# Altium schematic sheet 08_USB.SchDoc: USB
size A3; Organization: Lime Microsystems; Address1: Surrey Tech Centre; Address2: Guildford GU2 7YG; Address3: Surrey; Address4: United Kingdom; Revision: v1.0; SheetNumber: 8; SheetTotal: 12
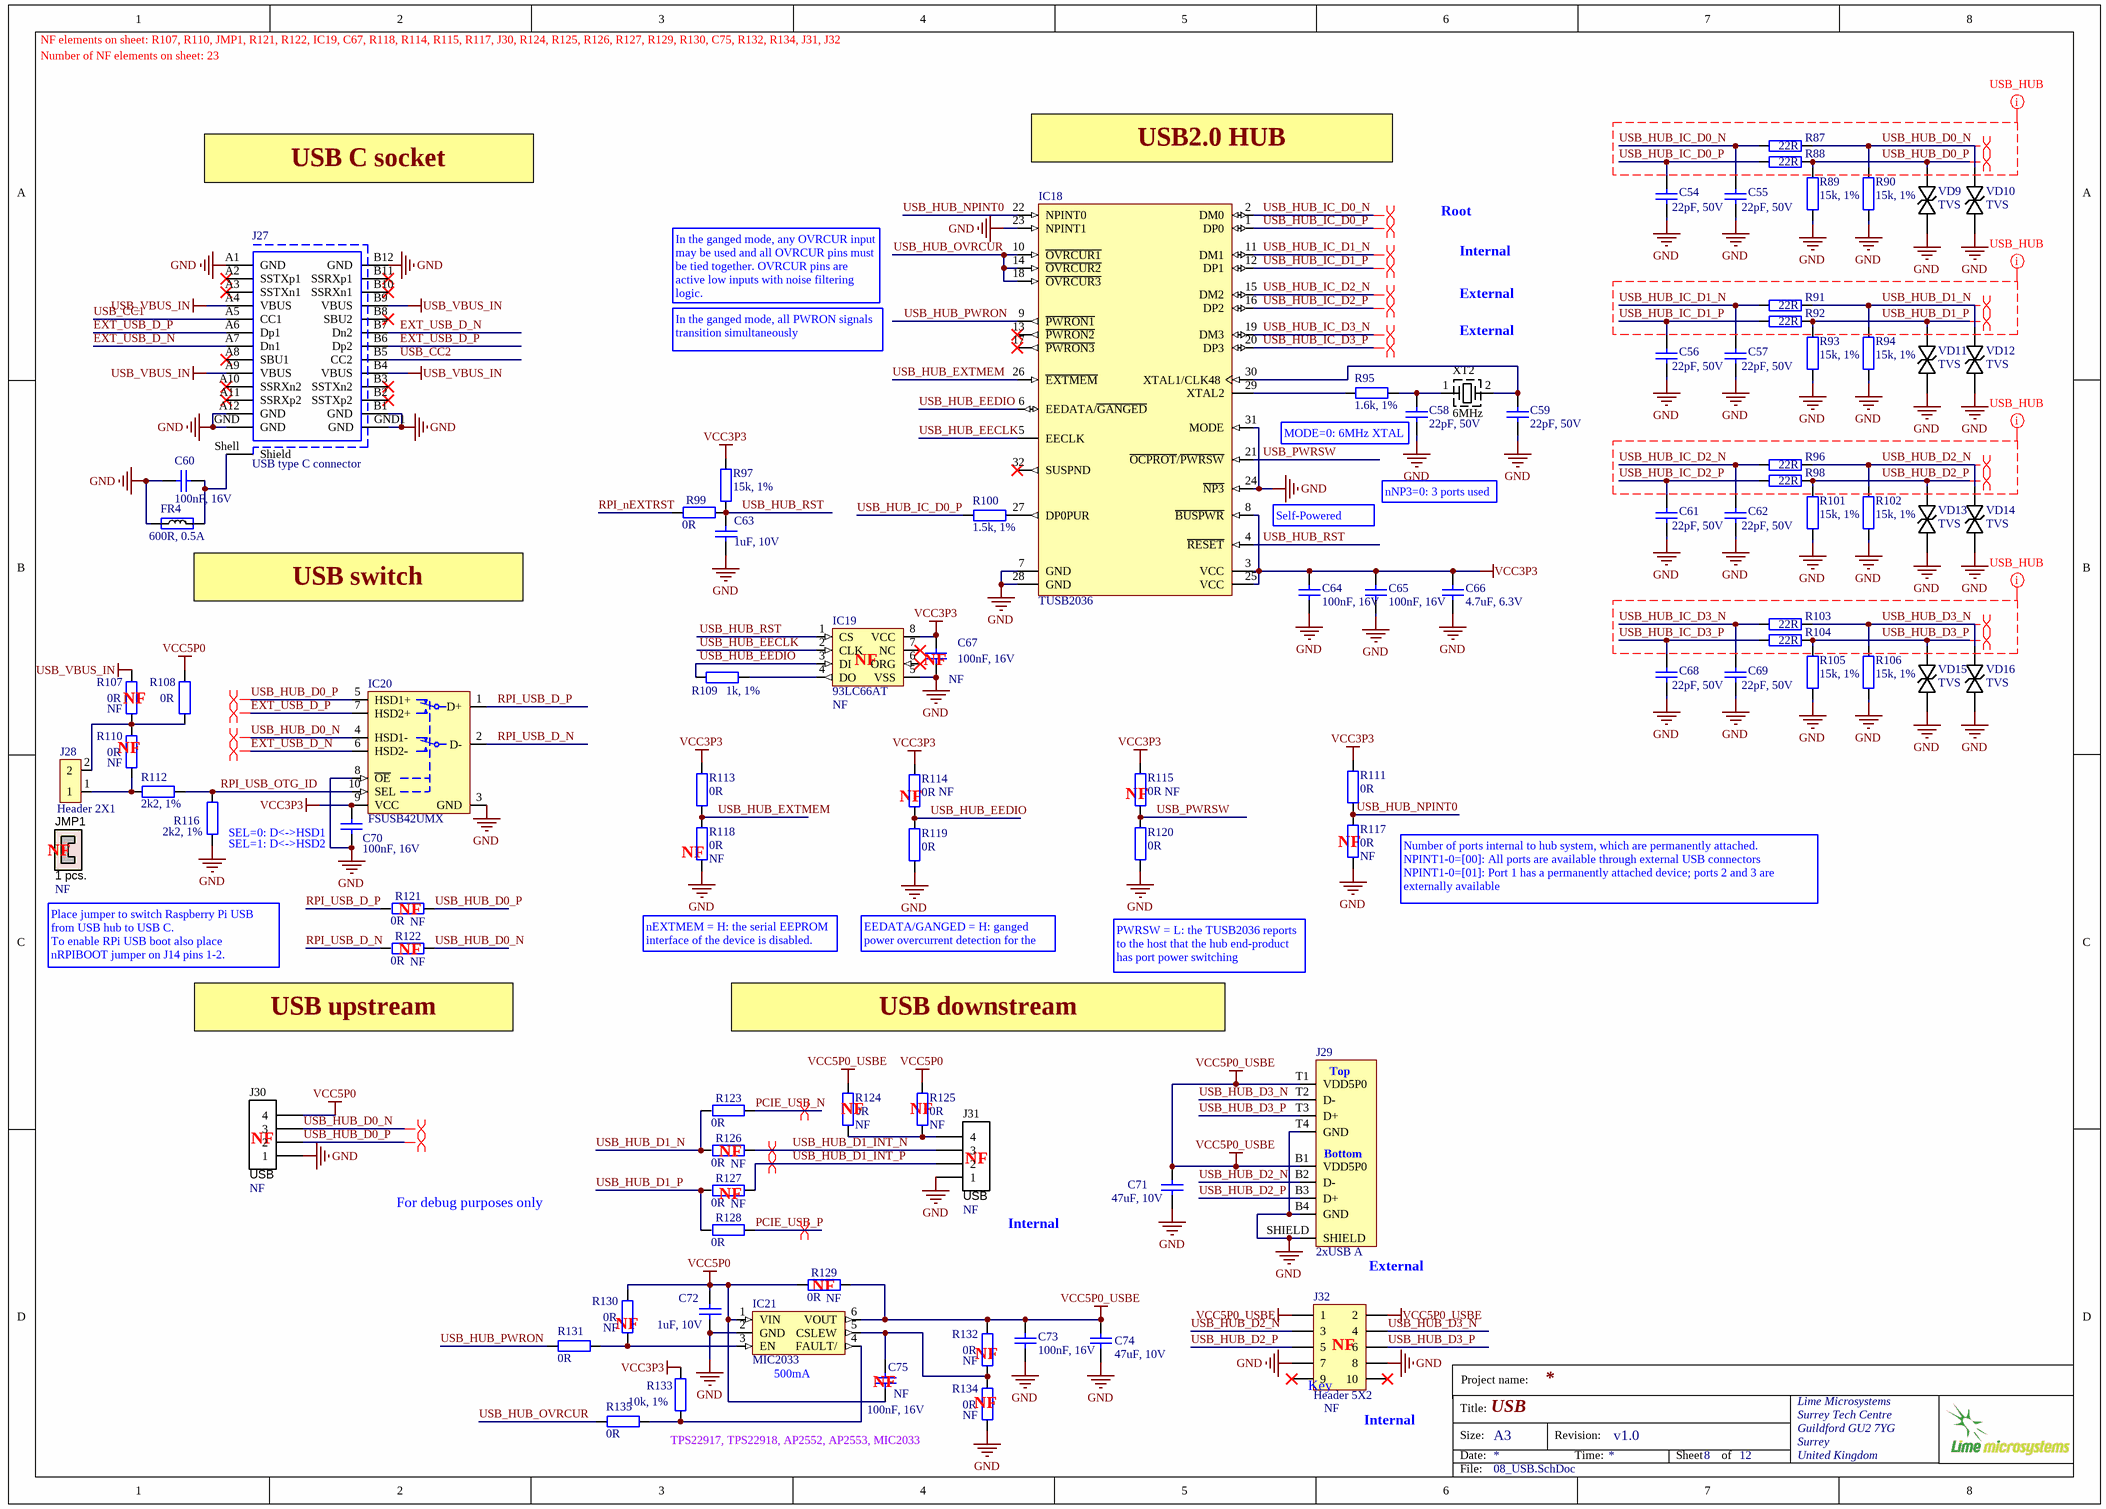
[diagram p0: 08_USB.SchDoc]

## Parts
C54  22pF, 50V  [CAP0402]
C55  22pF, 50V  [CAP0402]
C56  22pF, 50V  [CAP0402]
C57  22pF, 50V  [CAP0402]
C58  22pF, 50V  [CAP0402]
C59  22pF, 50V  [CAP0402]
C60  100nF, 16V  [CAP0402]
C61  22pF, 50V  [CAP0402]
C62  22pF, 50V  [CAP0402]
C63  1uF, 10V  [CAP0402]
C64  100nF, 16V  [CAP0402]
C65  100nF, 16V  [CAP0402]
C66  4.7uF, 6.3V  [CAP0402]
C67  100nF, 16V  Assembly Info: NF  [CAP0402]
C68  22pF, 50V  [CAP0402]
C69  22pF, 50V  [CAP0402]
C70  100nF, 16V  [CAP0402]
C71  47uF, 10V  [CAP1206]
C72  1uF, 10V  [CAP0402]
C73  100nF, 16V  [CAP0402]
C74  47uF, 10V  [CAP1206]
C75  100nF, 16V  Assembly Info: NF  [CAP0402]
FR4  600R, 0.5A  [RES0402]
IC18  TUSB2036  [TUSB2036_USB_HUB_32-LQFP]
IC19  93LC66AT  Assembly Info: NF  [SOIC127P600-8DL_v2]
IC20  FSUSB42UMX  [FSUSB42UMX]
IC21  MIC2033  [SOT23-6]
J27  USB type C connector  [DUAL_USB-C_632723100011]
J28  Header 2X1  [HDR_1x2]
J29  2xUSB A  [USB_typeA_double_USBR-A-D-F-O-TH]
J30  USB  Assembly Info: NF  [HEADER4X1_TH]
J31  USB  Assembly Info: NF  [HEADER4X1_TH]
J32  Header 5X2  Assembly Info: NF  [Header5x2_TH]
JMP1  1 pcs.  Assembly Info: NF  (mechanical)
R87  22R  [RES0402]
R88  22R  [RES0402]
R89  15k, 1%  [RES0402]
R90  15k, 1%  [RES0402]
R91  22R  [RES0402]
R92  22R  [RES0402]
R93  15k, 1%  [RES0402]
R94  15k, 1%  [RES0402]
R95  1.6k, 1%  [RES0402]
R96  22R  [RES0402]
R97  15k, 1%  [RES0402]
R98  22R  [RES0402]
R99  0R  [RES0402]
R100  1.5k, 1%  [RES0402]
R101  15k, 1%  [RES0402]
R102  15k, 1%  [RES0402]
R103  22R  [RES0402]
R104  22R  [RES0402]
R105  15k, 1%  [RES0402]
R106  15k, 1%  [RES0402]
R107  0R  Assembly Info: NF  [RES0402]
R108  0R  [RES0402]
R109  1k, 1%  [RES0402]
R110  0R  Assembly Info: NF  [RES0402]
R111  0R  [RES0402]
R112  2k2, 1%  [RES0402]
R113  0R  [RES0402]
R114  0R  Assembly Info: NF  [RES0402]
R115  0R  Assembly Info: NF  [RES0402]
R116  2k2, 1%  [RES0402]
R117  0R  Assembly Info: NF  [RES0402]
R118  0R  Assembly Info: NF  [RES0402]
R119  0R  [RES0402]
R120  0R  [RES0402]
R121  0R  Assembly Info: NF  [RES0402]
R122  0R  Assembly Info: NF  [RES0402]
R123  0R  [RES0402]
R124  0R  Assembly Info: NF  [RES0402]
R125  0R  Assembly Info: NF  [RES0402]
R126  0R  Assembly Info: NF  [RES0402]
R127  0R  Assembly Info: NF  [RES0402]
R128  0R  [RES0402]
R129  0R  Assembly Info: NF  [RES0402]
R130  0R  Assembly Info: NF  [RES0402]
R131  0R  [RES0402]
R132  0R  Assembly Info: NF  [RES0402]
R133  10k, 1%  [RES0402]
R134  0R  Assembly Info: NF  [RES0402]
R135  0R  [RES0402]
VD9  TVS  [SOD323]
VD10  TVS  [SOD323]
VD11  TVS  [SOD323]
VD12  TVS  [SOD323]
VD13  TVS  [SOD323]
VD14  TVS  [SOD323]
VD15  TVS  [SOD323]
VD16  TVS  [SOD323]
XT2  6MHz  [CRYSTAL_ABLS-6.000MHZ-B4-T]

## Nets
GND: C54.1 C55.1 C56.1 C57.1 C58.1 C59.1 C60.2 C61.1 C62.1 C63.2 C64.2 C65.2 C66.1 C67.2 C68.1 C69.1 C70.2 C71.1 C72.2 C73.2 C74.1 FR4.1 IC18.7(GND) IC18.23(NPINT1) IC18.24(~{NP3}) IC18.28(GND) IC18.31(MODE) IC19.5(VSS) IC20.3(GND) IC20.8(~{OE}) IC21.2(GND) J27.A1(GND) J27.A12(GND) J27.B1(GND) J27.B12(GND) J27.GND J27.GND1(GND) J29.B4(GND) J29.SHIELD J29.T4(GND) J30.1 J31.1 J32.7 J32.8 R89.2 R90.2 R93.2 R94.2 R101.2 R102.2 R105.2 R106.2 R116.2 R117.2 R118.2 R119.2 R120.2 R134.1 VD9.K VD10.K VD11.K VD12.K VD13.K VD14.K VD15.K VD16.K
USB_VBUS_IN: J27.A4(VBUS) J27.A9(VBUS) J27.B4(VBUS) J27.B9(VBUS) R107.2
VCC3P3: C64.1 C65.1 C66.2 C67.1 C70.1 IC18.3(VCC) IC18.8(~{BUSPWR}) IC18.25(VCC) IC19.8(VCC) IC20.9(VCC) R97.1 R111.1 R113.1 R114.1 R115.1 R133.2
VCC5P0: C72.1 C75.2 IC21.1(VIN) J30.4 R108.2 R125.1 R129.2 R130.2
VCC5P0_USBE: C71.2 C73.1 C74.2 IC21.6(VOUT) J29.B1(VDD5P0) J29.T1(VDD5P0) J32.1 J32.2 R124.1 R129.1 R132.2
EXT_USB_D_N: IC20.6(HSD2-) J27.A7(Dn1) J27.B7(Dn2)
EXT_USB_D_P: IC20.7(HSD2+) J27.A6(Dp1) J27.B6(Dp2)
PCIE_USB_N: R123.1
PCIE_USB_P: R128.1
RPI_nEXTRST: R99.2
RPI_USB_D_N: IC20.2(D-) R122.2
RPI_USB_D_P: IC20.1(D+) R121.2
RPI_USB_OTG_ID: IC20.10(SEL) R112.2 R116.1
USB_CC1: J27.A5(CC1)
USB_CC2: J27.B5(CC2)
USB_HUB_D0_N: IC20.4(HSD1-) J30.3 R87.2 R90.1 R122.1 VD10.A
USB_HUB_D0_P: IC20.5(HSD1+) J30.2 R88.2 R89.1 R121.1 VD9.A
USB_HUB_D1_INT_N: J31.3 R126.1
USB_HUB_D1_INT_P: J31.2 R127.1
USB_HUB_D1_N: R91.2 R94.1 R123.2 R126.2 VD12.A
USB_HUB_D1_P: R92.2 R93.1 R127.2 R128.2 VD11.A
USB_HUB_D2_N: J29.B2(D-) J32.3 R96.2 R102.1 VD14.A
USB_HUB_D2_P: J29.B3(D+) J32.5 R98.2 R101.1 VD13.A
USB_HUB_D3_N: J29.T2(D-) J32.4 R103.2 R106.1 VD16.A
USB_HUB_D3_P: J29.T3(D+) J32.6 R104.2 R105.1 VD15.A
USB_HUB_EECLK: IC18.5(EECLK) IC19.2(CLK)
USB_HUB_EEDIO: IC18.6(EEDATA/~{GANGED}) IC19.3(DI) R109.1 R114.2 R119.1
USB_HUB_EXTMEM: IC18.26(~{EXTMEM}) R113.2 R118.1
USB_HUB_IC_D0_N: C55.2 IC18.2(DM0) R87.1
USB_HUB_IC_D0_P: C54.2 IC18.1(DP0) R88.1 R100.1
USB_HUB_IC_D1_N: C57.2 IC18.11(DM1) R91.1
USB_HUB_IC_D1_P: C56.2 IC18.12(DP1) R92.1
USB_HUB_IC_D2_N: C62.2 IC18.15(DM2) R96.1
USB_HUB_IC_D2_P: C61.2 IC18.16(DP2) R98.1
USB_HUB_IC_D3_N: C69.2 IC18.19(DM3) R103.1
USB_HUB_IC_D3_P: C68.2 IC18.20(DP3) R104.1
USB_HUB_NPINT0: IC18.22(NPINT0) R111.2 R117.1
USB_HUB_OVRCUR: IC18.10(~{OVRCUR1}) IC18.14(~{OVRCUR2}) IC18.18(~{OVRCUR3}) R135.2
USB_HUB_PWRON: IC18.9(~{PWRON1}) R131.2
USB_HUB_RST: C63.1 IC18.4(~{RESET}) IC19.1(CS) R97.2 R99.1
USB_PWRSW: IC18.21(~{OCPROT}/~{PWRSW}) R115.2 R120.1
NetC58_2: C58.2 R95.2 XT2.1(X)
NetC59_2: C59.2 IC18.30(XTAL1/CLK48) XT2.2(X)
NetC60_1: C60.1 FR4.2 J27.Shell(Shield)
NetC75_1: C75.1 IC21.5(CSLEW) R132.1 R134.2
NetIC18_27: IC18.27(DP0PUR) R100.2
NetIC18_29: IC18.29(XTAL2) R95.1
NetIC19_4: IC19.4(DO) R109.2
NetIC21_3: IC21.3(EN) R130.1 R131.1
NetIC21_4: IC21.4(FAULT/) R133.1 R135.1
NetJ28_1: J28.1 R110.1 R112.1
NetJ28_2: J28.2 R107.1 R108.1 R110.2
NetJ31_4: J31.4 R124.2 R125.2

Not connected (* = marked no-connect by the designer): IC18 13(~{PWRON2})* 17(~{PWRON3})* 32(SUSPND)*; IC19 6(ORG)* 7(NC)*; J27 A2(SSTXp1)* A3(SSTXn1)* A8(SBU1)* A10(SSRXn2)* A11(SSRXp2)* B2(SSTXp2)* B3(SSTXn2)* B8(SBU2)* B10(SSRXn1)* B11(SSRXp1)*; J32 9* 10*; JMP1 1 2

## Layout directives
differential pair: EXT_USB_D_N, EXT_USB_D_P, PCIE_USB_N, PCIE_USB_P, USB_HUB_D0_N, USB_HUB_D0_P, USB_HUB_D1_INT_N, USB_HUB_D1_INT_P, USB_HUB_D1_N, USB_HUB_D1_P, USB_HUB_D2_N, USB_HUB_D2_P, USB_HUB_D3_N, USB_HUB_D3_P, USB_HUB_IC_D0_N, USB_HUB_IC_D0_P, USB_HUB_IC_D1_N, USB_HUB_IC_D1_P, USB_HUB_IC_D2_N, USB_HUB_IC_D2_P, USB_HUB_IC_D3_N, USB_HUB_IC_D3_P
net class USB_HUB: USB_HUB_D0_N, USB_HUB_D0_P, USB_HUB_D1_N, USB_HUB_D1_P, USB_HUB_D2_N, USB_HUB_D2_P, USB_HUB_D3_N, USB_HUB_D3_P, USB_HUB_IC_D0_N, USB_HUB_IC_D0_P, USB_HUB_IC_D1_N, USB_HUB_IC_D1_P, USB_HUB_IC_D2_N, USB_HUB_IC_D2_P, USB_HUB_IC_D3_N, USB_HUB_IC_D3_P

## Notes on the sheet
- NF elements on sheet: R107, R110, JMP1, R121, R122, IC19, C67, R118, R114, R115, R117, J30, R124, R125, R126, R127, R129, R130, C75, R132, R134, J31, J32
- Number of NF elements on sheet: 23
- USB C socket
- (near IC18) USB2.0 HUB
- Root
- In the ganged mode, any OVRCUR input may be used and all OVRCUR pins must be tied together. OVRCUR pins are active low inputs with noise filtering logic.
- Internal
- External
- In the ganged mode, all PWRON signals
  transition simultaneously
- (near C58) MODE=0: 6MHz XTAL
- nNP3=0: 3 ports used
- Self-Powered
- (near FR4) USB switch
- (near R107) NF
- (near IC19) NF
- (near C67) NF
- (near R110) NF
- (near JMP1) NF
- (near R116) SEL=0: D<->HSD1
- (near R116) SEL=1: D<->HSD2
- (near R118) NF
- (near R114) NF
- (near R115) NF
- (near R117) NF
- (near R121) NF
- Number of ports internal to hub system, which are permanently attached.
  NPINT1-0=[00]: All ports are available through external USB connectors
  NPINT1-0=[01]: Port 1 has a permanently attached device; ports 2 and 3 are externally available
- Place jumper to switch Raspberry Pi USB from USB hub to USB C.
  To enable RPi USB boot also place nRPIBOOT jumper on J14 pins 1-2.
- (near R122) NF
- nEXTMEM = H: the serial EEPROM interface of the device is disabled.
- (near R119) EEDATA/GANGED = H: ganged power overcurrent detection for the downstream ports.
- PWRSW = L: the TUSB2036 reports to the host that the hub end-product has port power switching
- (near R122) USB upstream
- USB downstream
- (near R124) NF
- (near R125) NF
- (near J30) NF
- (near R126) NF
- (near J31) NF
- (near J30) For debug purposes only
- (near R127) NF
- (near J31) Internal
- (near R130) NF
- (near R129) NF
- (near J29) External
- (near IC21) 500mA
- (near C75) NF
- (near R132) NF
- (near J32) Key
- (near J32) NF
- TPS22917, TPS22918, AP2552, AP2553, MIC2033
- (near R134) NF
- (near J32) Internal
- Project name:
- Title:
- Size:
- Date:
- A3
- Revision:
- Time:
- Sheet
- of
- File:
- (in symbol USB_typeA_double_USBR-A-D-F-O-TH) Top; Bottom

## Library data of the parts
C54-C59 C61 C62 C68 C69 = Cap_0402: Manufacturer: Yageo; Manufacturer Part Number 1: CC0402JRNPO9BN220; Part Description: 22pF ±5% 50V C0G, NP0 Ceramic Capacitor -55°C ~ 125°C Surface Mount, MLCC 0402 (1005 Metric) 0.039" L x 0.020" W (1.00mm x 0.50mm); Tolerance: ±5%; Temperature Coefficient: C0G, NP0; Value: 22pF, 50V; Supplier 1: Digi-Key; Supplier Part Number 1: 311-1018-2-ND; Category: Capacitors; Voltage - Rated: 50V; Packaging: Tape & Reel (TR); RoHS: RoHS Compliant; Capacitance: 22pF; Operating Temperature: -55°C ~ 125°C; Mounting Type: Surface Mount, MLCC; Height - Seated (Max): -; Size / Dimension: 0.039" L x 0.020" W (1.00mm x 0.50mm); Ratings: -; Applications: General Purpose; Thickness (Max): 0.022" (0.55mm); Lead Spacing: -; Lead Style: -; Features: -; Package / Case: 0402 (1005 Metric)
C60 = Cap_0603: Manufacturer Part Number 1: GRM155R71C104KA88D; Part Description: 0.10µF ±10% 16V Ceramic Capacitor X7R 0402 (1005 Metric); Brand: Murata Electronics; Tolerance: 10 %; Type: General Purpose MLCC; Capacitance: 0.1 uF; Temperature Coefficient / Code: +/- 15 %; Supplier 1: Mouser; Supplier Part Number 1: 81-GRM155R71C104KA88; Case Code - in: 0402; Manufacturer: Murata Electronics; Category: Multilayer Ceramic Capacitors MLCC - SMD/SMT; Voltage Rating DC: 16 V; Value: 100nF, 16V; Manufacturer Part Number: GRM155R71C104KA88D
C63 C72 = Cap_0402: Manufacturer Part Number 1: CC0402MRX5R6BB105; Manufacturer: Yageo; Part Description: 1µF 10V Ceramic Capacitor X5R 0402 (1005 Metric) 0.039" L x 0.020" W (1.00mm x 0.50mm); Voltage Rating: 10; Capacitance Tolerance: ± 10%; Product Range: TDK - C Series; Ceramic Capacitor Case: 0402 [1005 Metric]; Capacitance: 1; Dielectric Characteristic: X6; Value: 1uF, 10V; Supplier 1: Digi-Key; Supplier Part Number 1: 311-1732-1-ND; MSL: -; RoHS: YES
C64 C65 C67 C70 = Cap_0402: Manufacturer: Murata Electronics; Manufacturer Part Number: GRM155R71C104KA88D; Part Description: 0.10µF ±10% 16V Ceramic Capacitor X7R 0402 (1005 Metric); Tolerance: 10 %; Type: General Purpose MLCC; Capacitance: 0.1 uF; Case Length: 1 mm; Dielectric: X7R; Case Height: 0.5 mm; Temperature Coefficient / Code: +/- 15 %; Value: 100nF, 16V; Supplier 1: Mouser; Supplier Part Number 1: 81-GRM155R71C104KA88; Case Code - in: 0402; RoHS: RoHS Compliant; Operating Temperature Range: - 55 C to + 125 C; Series: GRM; Termination Style: SMD/SMT; Package / Case: 0402 (1005 metric); Voltage Rating DC: 16 V; Maximum Operating Temperature: + 125 C; Case Code - mm: 1005; Minimum Operating Temperature: - 55 C; Product Category: Low & Medium Capacitance SMD Ceramic Chip Capacitors; Packaging: Reel; Product: General Type MLCCs; Category: Multilayer Ceramic Capacitors MLCC - SMD/SMT; Brand: Murata Electronics; Case Width: 0.5 mm; RoHS - Mouser: Y; Standard Pack Qty: 10000; Minimum Order Quantity: 1; Reeling: True; Manufacturer Part Number 1: GRM155R71C104KA88D
C66 = Cap_0402: Manufacturer: Murata Electronics North America; Manufacturer Part Number 1: GRM155R60J475ME87D; Part Description: 4.7µF ±20% 6.3V X5R Ceramic Capacitor -55°C ~ 85°C Surface Mount, MLCC 0402 (1005 Metric) 0.039" L x 0.020" W (1.00mm x 0.50mm); Tolerance: ±20%; Capacitance: 4.7µF; Temperature Coefficient: X5R; Lead Style: -; Ratings: -; Height - Seated (Max): -; Thickness (Max): 0.022" (0.55mm); Voltage - Rated: 6.3V; Packaging: Cut Tape (CT); Lead Spacing: -; Category: Capacitors; Supplier Part Number 1: 490-5408-1-ND; Applications: General Purpose; Operating Temperature: -55°C ~ 85°C; Mounting Type: Surface Mount, MLCC; Features: Derating Recommended; RoHS: RoHS Compliant; Supplier 1: Digi-Key; Package / Case: 0402 (1005 Metric); Size / Dimension: 0.039" L x 0.020" W (1.00mm x 0.50mm); Value: 4.7uF, 6.3V
C71 C74 = Cap_1206: Manufacturer: TDK Corporation; Manufacturer Part Number 1: C3216X6S1A476M160AC; Part Description: 47µF ±20% 10V Ceramic Capacitor X6S 1206 (3216 Metric); Notification: Current market demand for these product types have resulted in fluctuating and extending lead times. Lead times may differ.; Tolerance: ±20%; Temperature Coefficient: X6S; Value: 47uF, 10V; RoHS: RoHS Compliant; Packaging: Cut Tape (CT); Operating Temperature: -55°C ~ 105°C; Voltage - Rated: 10V; Height - Seated (Max): -; Ratings: -; Applications: General Purpose; Features: Low ESL; Size / Dimension: 0.126" L x 0.063" W (3.20mm x 1.60mm); Supplier 1: Digi-Key; Lead Spacing: -; Supplier Part Number 1: 445-6010-1-ND; Thickness (Max): 0.071" (1.80mm); Failure Rate: -; Category: Capacitors; Lead Style: -; Part Status: Active; Mounting Type: Surface Mount, MLCC; Package / Case: 1206 (3216 Metric)
C73 C75 = Cap_0402: Manufacturer: Murata Electronics; Manufacturer Part Number 1: GRM155R71C104KA88D; Part Description: 0.10µF ±10% 16V Ceramic Capacitor X7R 0402 (1005 Metric); Tolerance: 10 %; Type: General Purpose MLCC; Capacitance: 0.1 uF; Case Length: 1 mm; Dielectric: X7R; Case Height: 0.5 mm; Temperature Coefficient / Code: +/- 15 %; Value: 100nF, 16V; Supplier 1: Mouser; Supplier Part Number 1: 81-GRM155R71C104KA88; Case Code - in: 0402; RoHS: RoHS Compliant; Operating Temperature Range: - 55 C to + 125 C; Series: GRM; Termination Style: SMD/SMT; Package / Case: 0402 (1005 metric); Voltage Rating DC: 16 V; Maximum Operating Temperature: + 125 C; Case Code - mm: 1005; Minimum Operating Temperature: - 55 C; Product Category: Low & Medium Capacitance SMD Ceramic Chip Capacitors; Packaging: Reel; Product: General Type MLCCs; Category: Multilayer Ceramic Capacitors MLCC - SMD/SMT; Brand: Murata Electronics; Case Width: 0.5 mm; RoHS - Mouser: Y; Standard Pack Qty: 10000; Minimum Order Quantity: 1; Reeling: True; Manufacturer Part Number: GRM155R71C104KA88D
FR4 = Ferrite: Manufacturer: Murata; Manufacturer Part Number 1: BLM15AX601SN1D; Part Description: - Ferrite Bead 0402 (1005 Metric) 500mA 340mOhm; Tolerance: 25%; Current Rating: 500mA; Number of Lines: 1; DC Resistance (DCR): 340mR; Test Frequency: 100MHz; Value: 600R, 0.5A; Supplier 1: Digi-Key; Supplier Part Number 1: 490-5441-1-ND; Stock 1: 416370; Pricing 1: 1=0.1, 10=0.06, 25=0.0552, 50=0.0496, 100=0.0363, 250=0.0264, 500=0.0242, 1000=0.0209, 5000=0.0165 (USD); Case/Package: 0402; Number of Pins: 2; Case Code (Metric): 1005; Case Code (Imperial): 0402; Core Material: Ferrite; Material: Steel,Ferrite; Min Operating Temperature: -55°C; Max Operating Temperature: 125°C; Package Quantity: 1; Packaging: Tape and Reel; Series: BLM15AX_SN; Impedance: 600R; Max Current Rating: 500mA; Termination: SMD/SMT; Max DC Current: 500mA; Number of Circuits: 1; DC Resistance-Max: 340mR; Length: 1mm; Width: 0.5mm; Height: 0.5mm; Depth: 0.5mm; REACH SVHC: No SVHC; Lead Free: Lead Free; RoHS Compliant: Yes; ComponentLink1URL: https://www.murata.com/en-us/products/productdata/8796740059166/ENFA0018.pdf?src-supplier=Digi-Key; ComponentLink1Description: https://www.murata.com/en-us/products/productdata/8796740059166/ENFA0018.pdf?src-supplier=Digi-Key; ComponentLink2URL: http://search.murata.co.jp/Ceramy/image/img/PDF/ENG/L0110S0100BLM15AX_SN.pdf?src-supplier=Future+Electronics; ComponentLink2Description: http://search.murata.co.jp/Ceramy/image/img/PDF/ENG/L0110S0100BLM15AX_SN.pdf?src-supplier=Future+Electronics; ComponentLink3URL: http://www.produktinfo.conrad.com/datenblaetter/1100000-1199999/001171675-da-01-en-CHIP_DROSSEL0402_600R_420MA_1_0X0_5MM.pdf?src-supplier=Conrad; ComponentLink3Description: http://www.produktinfo.conrad.com/datenblaetter/1100000-1199999/001171675-da-01-en-CHIP_DROSSEL0402_600R_420MA_1_0X0_5MM.pdf?src-supplier=Conrad; ComponentLink4URL: http://www.produktinfo.conrad.com/datenblaetter/1100000-1199999/001172169-da-01-en-DROSSEL_0402_600R_1_0X0_5MM_10000ST.pdf?src-supplier=Conrad; ComponentLink4Description: http://www.produktinfo.conrad.com/datenblaetter/1100000-1199999/001172169-da-01-en-DROSSEL_0402_600R_1_0X0_5MM_10000ST.pdf?src-supplier=Conrad
IC18 = TUSB2036_USB_HUB: Part Description: USB Hub Controller USB 2.0 USB Interface 32-LQFP (7x7); Manufacturer: Texas Instruments; Manufacturer Part Number 1: TUSB2036VF; Operating Supply Voltage: 3.3V; Operating Supply Current: 40mA; Data Rate: 12Mbps; Min Supply Voltage: 3V; Max Supply Voltage: 3.6V; Number of Ports: 3; USB Standard: USB 2.0; ComponentLink1URL: https://datasheet.ciiva.com/1505/1535702-1505189.pdf?src-supplier=Element14; ComponentLink1Description: https://datasheet.ciiva.com/1505/1535702-1505189.pdf?src-supplier=Element14; ComponentLink2URL: https://datasheet.ciiva.com/1613/tusb2036-1613315.pdf?src-supplier=Newark; ComponentLink2Description: https://datasheet.ciiva.com/1613/tusb2036-1613315.pdf?src-supplier=Newark; ComponentLink3URL: https://datasheet.ciiva.com/15134/getdatasheetpartid-225880-15134503.pdf?src-supplier=Verical; ComponentLink3Description: https://datasheet.ciiva.com/15134/getdatasheetpartid-225880-15134503.pdf?src-supplier=Verical; ComponentLink4URL: https://datasheet.ciiva.com/5835/1535702-5835498.pdf?src-supplier=Farnell; ComponentLink4Description: https://datasheet.ciiva.com/5835/1535702-5835498.pdf?src-supplier=Farnell; ComponentLink5URL: https://datasheet.ciiva.com/1695/tusb2036-1695700.pdf?src-supplier=Digi-Key; ComponentLink5Description: https://datasheet.ciiva.com/1695/tusb2036-1695700.pdf?src-supplier=Digi-Key; ComponentLink6URL: https://datasheet.ciiva.com/41461/001187495-da-01-en-ic-2-3-port-usb-h-tusb2036vf-lqfp-32-tid-41461301.pdf?src-supplier=Conrad; ComponentLink6Description: https://datasheet.ciiva.com/41461/001187495-da-01-en-ic-2-3-port-usb-h-tusb2036vf-lqfp-32-tid-41461301.pdf?src-supplier=Conrad; Supplier 1: Digi-Key; Supplier Part Number 1: 296-11086-ND; Stock 1: 77; Pricing 1: 1=4,18000, 10=3,75400, 25=3,54880, 80=3,07575, 250=2,91796, 500=2,61828, 1000=2,38080 (USD); RoHS: Yes; Case/Package: LQFP; Number of Pins: 32; Weight: 0.006148oz; Min Operating Temperature: 0°C; Max Operating Temperature: 70°C; Package Quantity: 250; Packaging: Tray; Termination: SMD/SMT; Length: 7mm; Width: 7mm; Height: 1.4mm; Radiation Hardening: No; Lead Free: Lead Free; RoHS Compliant: Yes; REACH SVHC: No SVHC
IC19 = 93LC66AT-I/SN_EEPROM: Part Description: EEPROM Memory IC 4Kb (512 x 8) SPI 2MHz 8-SOIC; Manufacturer: Microchip Technology; Memory Type: Non-Volatile; Memory Format: EEPROM; Memory Size: 4Kb (512 x 8); Write Cycle Time - Word, Page: 6ms; Memory Interface: SPI; Voltage - Supply: 2.5 V ~ 5.5 V; Supplier 1: Digi-Key; Manufacturer Part Number 1: 93LC66AT-I/SN; RoHS: RoHS Compliant; Category: Integrated Circuits (ICs); Stock 1: 6857; Pricing 1: 1=0.27, 25=0.2576, 100=0.2543 (USD); Packaging: Digi-Reel®; Part Status: Active; Technology: EEPROM; Operating Temperature: -40°C ~ 85°C (TA); Mounting Type: Surface Mount; Package / Case: 8-SOIC (0.154", 3.90mm Width); Supplier Device Package: 8-SOIC; ComponentLink1URL: http://www.microchip.com/mymicrochip/filehandler.aspx?ddocname=en011819; ComponentLink1Description: http://www.microchip.com/mymicrochip/filehandler.aspx?ddocname=en011819; Supplier Part Number 1: 93LC66AT-I/SNDKR-ND
IC20 = FSUSB42UMX: Part Description: USB Switch IC 1 Channel 10-UMLP (1.8x1.4); Manufacturer: ON Semiconductor; Switch Circuit: DPDT; On-State Resistance (Max): 6.5 Ohm; Voltage - Supply, Single (V+): 2.4 V ~ 4.4 V; -3db Bandwidth: 720MHz; Supplier 1: Digi-Key; Manufacturer Part Number 1: FSUSB42UMX; RoHS: RoHS Compliant; Category: Integrated Circuits (ICs); Stock 1: 8344; Pricing 1: 1=0.59, 10=0.502, 100=0.3749, 500=0.29458, 1000=0.22763 (USD); Packaging: Cut Tape (CT); Part Status: Active; Applications: USB; Multiplexer/Demultiplexer Circuit: -; Voltage - Supply, Dual (V±): -; Features: Break-Before-Make, USB 2.0; Operating Temperature: -40°C ~ 85°C (TA); Package / Case: 10-UFQFN; Supplier Device Package: 10-UMLP (1.8x1.4); Base Part Number: FSUSB42; ComponentLink1URL: https://www.fairchildsemi.com/datasheets/FS/FSUSB42.pdf; ComponentLink1Description: https://www.fairchildsemi.com/datasheets/FS/FSUSB42.pdf; Supplier Part Number 1: FSUSB42UMXCT-ND
IC21 = MIC2033_power_switch: Manufacturer: Microchip; Manufacturer Part Number 1: MIC2033-05AYM6-TR; Part Description: Power Switch ICs - Power Distribution 500mA High-Side, Power Distribution Switch; Number of Outputs: 1; Interface: On/Off; Max Output Current: 500mA; Fault Protection: Over Temperature; Output Configuration: High Side; Supplier 1: Digi-Key; Supplier Part Number 1: 576-4143-1-ND; Stock 1: 1966; Pricing 1: 1=0,80000, 25=0,65720, 100=0,61500 (USD); RoHS: Yes; Mount: Surface Mount; Case/Package: SOT-23-6; Number of Pins: 6; Min Operating Temperature: -40°C; Max Operating Temperature: 125°C; Packaging: Tape and Reel; Package Quantity: 3000; Series: -; Number of Switches: 1; RoHS Compliant: Yes; ComponentLink1URL: http://www.mouser.com/ds/2/268/mic2033-b-1076865.pdf?src-supplier=Mouser; ComponentLink1Description: http://www.mouser.com/ds/2/268/mic2033-b-1076865.pdf?src-supplier=Mouser; ComponentLink2URL: http://components.arrow.com/part/dataview/56727820S413982N1374?src-supplier=Arrow+Electronics; ComponentLink2Description: http://components.arrow.com/part/dataview/56727820S413982N1374?src-supplier=Arrow+Electronics; ComponentLink3URL: http://www.microchip.com/mymicrochip/filehandler.aspx?ddocname=en579457&src-supplier=Digi-Key; ComponentLink3Description: http://www.microchip.com/mymicrochip/filehandler.aspx?ddocname=en579457&src-supplier=Digi-Key
J27 = DUAL_USB-C_632723100011: Manufacturer: Wurth Electronics; Part Description: USB - C (Type - C) USB 3.1 (USB 3.1 Gen 2, Superspeed+) Receptacle Connector 24 Position Surface Mount, Right Angle; Through Hole; Number of Contacts: 24; Gender: Receptacle; ComponentLink1URL: http://www.alliedelec.com/m/d/e03b7b5d71e2d3e369c52d5c8eaca2b6.pdf?src-supplier=Allied+Electronics; ComponentLink1Description: http://www.alliedelec.com/m/d/e03b7b5d71e2d3e369c52d5c8eaca2b6.pdf?src-supplier=Allied+Electronics; ComponentLink2URL: http://www.jae.com/z-en/pdf_download_exec.cfm?param=SJ115995.pdf&src-supplier=Digi-Key; ComponentLink2Description: http://www.jae.com/z-en/pdf_download_exec.cfm?param=SJ115995.pdf&src-supplier=Digi-Key; Supplier 1: Digi-Key; Supplier Part Number 1: 732-9617-1-ND; Manufacturer Part Number 1: 632723100011; Stock 1: 1127; Pricing 1: 1=4,10000, 10=3,80000, 50=3,20000, 100=2,95000 (USD); RoHS: Yes; Mount: Surface Mount,Through Hole; Packaging: Tape and Reel; Connector Type: USB; ComponentLink3URL: https://www.mouser.com/ds/2/445/632723x00011-782157.pdf?src-supplier=Mouser; ComponentLink3Description: https://www.mouser.com/ds/2/445/632723x00011-782157.pdf?src-supplier=Mouser; ComponentLink4URL: https://katalog.we-online.de/em/datasheet/632723x00011.pdf?src-supplier=Digi-Key; ComponentLink4Description: https://katalog.we-online.de/em/datasheet/632723x00011.pdf?src-supplier=Digi-Key
J28 = Jumper: Manufacturer Part Number 1: 961102-6404-AR; Part Description: 2 Positions Header, Unshrouded Connector 0.100" (2.54mm) Through Hole Gold; Manufacturer: 3M; Connector Type: Header, Unshrouded; Supplier 1: Digi-Key; Supplier Part Number 1: 3M9447-ND; Contact Type: Male Pin; Color: Black; Mounting Type: Through Hole; Category: Connectors, Interconnects; Contact Finish: Gold
J29 = USB_typeA_double_USBR-A-D-F-O-TH: Manufacturer: Samtec; Part Description: USB - A USB 2.0 Receptacle Connector 8 Position Through Hole, Right Angle; Number of Contacts: 4; Number of Ports: 1; Max Voltage Rating (AC): 30V; Gender: Female; Supplier 1: Digi-Key; Manufacturer Part Number 1: USBR-A-D-F-O-TH; Stock 1: 2359; Pricing 1: 1=1.6, 10=1.448, 25=1.3592, 50=1.3002, 100=1.2411, 250=1.12292, 500=1.03426, 1000=0.8865, 2500=0.8274 (USD); Mount: Through Hole; Contact Material: Bronze; Contact Plating: Gold; Number of Terminals: 4; Housing Material: Thermoplastic; Min Operating Temperature: -50°C; Max Operating Temperature: 85°C; Packaging: Bulk; Termination: Solder; Orientation: Right Angle; Radiation Hardening: No; Supplier Part Number 1: SAM10376-ND
J30 J31 = Header4P: Header, 4-pin; Part Description: 4 Positions Header Connector 0.100" (2.54mm) Through Hole Gold; Manufacturer: Wurth Electronics Inc.; Manufacturer Part Number 1: 61300411121; Pitch - Mating: 0.100" (2.54mm); Number of Positions: 4; Number of Positions Loaded: All; Style: Board to Board or Cable; Shrouding: Unshrouded; Contact Length - Mating: 0.236" (6.00mm); Contact Length - Post: 0.118" (3.00mm); Overall Contact Length: 0.454" (11.54mm); Material Flammability Rating: UL94 V-0; Current Rating: 3A; Voltage Rating: 250V; Supplier 1: Digi-Key; Supplier Part Number 1: 732-5317-ND; RoHS: RoHS Compliant; Category: Connectors, Interconnects; Stock 1: 25204; Pricing 1: 1=0.18, 10=0.153, 25=0.1272, 50=0.106, 100=0.096, 1000=0.088 (USD); Packaging: Bulk; Part Status: Active; Connector Type: Header; Contact Type: Male Pin; Number of Rows: 1; Row Spacing - Mating: -; Mounting Type: Through Hole; Termination: Solder; Fastening Type: Push-Pull; Insulation Height: 0.100" (2.54mm); Contact Shape: Square; Contact Finish - Mating: Gold; Contact Finish Thickness - Mating: -; Contact Finish - Post: -; Contact Material: Copper Alloy; Insulation Material: Polybutylene Terephthalate (PBT); Features: -; Operating Temperature: -40°C ~ 125°C; Ingress Protection: -; Insulation Color: Black; Mated Stacking Heights: -; Contact Finish Thickness - Post: -; Applications: -; ComponentLink1URL: http://katalog.we-online.de/em/datasheet/6130xx11121.pdf; ComponentLink1Description: http://katalog.we-online.de/em/datasheet/6130xx11121.pdf
J32 = Header 5X2: Header, 5-Pin, Dual row; Manufacturer 1: Molex; Manufacturer Part Number: 0702461003; Part Description: Connector Header Through Hole 10 position 0.100" (2.54mm); Supplier 1: Digi-Key; Supplier Part Number 1: 0702461003-ND; Stock 1: 3341; Pricing 1: 1=2,58000, 10=2,19400, 120=1,81267, 1080=1,43105, 2520=1,33564 (USD); RoHS: Yes; ComponentLink1URL: https://datasheet.ciiva.com/2944/702461003-sd-2944145.pdf?src-supplier=Digi-Key; ComponentLink1Description: https://datasheet.ciiva.com/2944/702461003-sd-2944145.pdf?src-supplier=Digi-Key; ComponentLink2URL: https://datasheet.ciiva.com/29948/702465002-sd-29948508.pdf?src-supplier=Avnet; ComponentLink2Description: https://datasheet.ciiva.com/29948/702465002-sd-29948508.pdf?src-supplier=Avnet; Manufacturer: Molex; Manufacturer Part Number 1: 0702461003
JMP1 = JUMP_2P_CONN_HEADER: Shorting Jumper, 2-position, 1.27mm pitch; Part Description: 2 (1 x 2) Position Shunt Connector Black Closed Top 0.100" (2.54mm) Gold; Manufacturer: Sullins; Manufacturer Part Number 1: SPC02SYAN; Number of Positions: 2; Pitch: 0.1inch; Supplier 1: Digi-Key; Supplier Part Number 1: S9001-ND; Stock 1: 570741; Pricing 1: 1=0.1, 10=0.059, 25=0.044, 50=0.0378, 100=0.0365, 250=0.03152, 500=0.03024, 1000=0.02646, 2500=0.02394 (USD); Colour: Black; Contact Plating: Gold; Package Quantity: 1000; Packaging: Bulk; Height: 0.256inch; Lead Free: Lead Free; ComponentLink1URL: http://www.sullinscorp.com/images/SPC02SYAN-0-3293.pdf; ComponentLink1Description: http://www.sullinscorp.com/images/SPC02SYAN-0-3293.pdf; ComponentLink2URL: https://drawings-pdf.s3.amazonaws.com/11134.pdf; ComponentLink2Description: https://drawings-pdf.s3.amazonaws.com/11134.pdf
R87 R88 R91 R92 R96 R98 R103 R104 = Res_0402: Part Description: RES SMD 22 OHM 1% 1/16W 0402; Manufacturer Part Number 1: RC0402FR-0722RL; Manufacturer: Yageo; Tolerance: ±1%; Temperature Coefficient: ±100ppm/°C; Resistance (Ohms): 22; Supplier 1: Digi-Key; Supplier Part Number 1: 311-22.0LRTR-ND; Supplier Device Package: 0402; Composition: Thick Film; Category: Resistors; Value: 22R
R89 R90 R93 R94 R97 R101 R102 R105 R106 = Res_0402: Part Description: Thick Film Resistors - SMD 15 kOhms 62.5 mW 0402 1% AEC-Q200; Manufacturer: Yageo; Manufacturer Part Number 1: AC0402FR-0715KL; Voltage Rating: 50V; Resistance: 15kR; Power Rating: 62.5mW; Max Power Dissipation: 63mW; Temperature Coefficient: 100ppm/°C; Value: 15k, 1%; Supplier 1: Digi-Key; Supplier Part Number 1: YAG3444CT-ND; Stock 1: 358225; Pricing 1: 1=0,10000, 10=0,02100, 100=0,00860, 1000=0,00385, 2500=0,00334, 5000=0,00276 (USD); RoHS: Yes; Case/Package: 0402; Case Code (Imperial): 0402; Case Code (Metric): 1005; Weight: 2.3E-05oz; Min Operating Temperature: -55°C; Max Operating Temperature: 155°C; Tolerance: 1%; Packaging: Tape and Reel; Resistor Type: Thick Film; Number of Terminations: 2; Termination: SMD/SMT; Features: Moisture Resistant,Automotive AEC-Q200; Series: AC; Length: 0.039inch; Width: 0.02inch; Height: 0.015inch; RoHS Compliant: Yes; ComponentLink1URL: https://datasheet.ciiva.com/12576/pyu-ac-51-rohs-l-2-12576779.pdf?src-supplier=Mouser; ComponentLink1Description: https://datasheet.ciiva.com/12576/pyu-ac-51-rohs-l-2-12576779.pdf?src-supplier=Mouser
R95 = Res_0402: Manufacturer Part Number 1: RC0402FR-071K6L; Manufacturer: Yageo; Part Description: 1.6 kOhms ±1% 0.063W, 1/16W Chip Resistor 0402 (1005 Metric) Moisture Resistant Thick Film; Temperature Coefficient: ±100ppm/°C; Power (Watts): 0.063W, 1/16W; Value: 1.6k, 1%; Tolerance: ±1%; RoHS: RoHS Compliant; Package / Case: 0402 (1005 Metric); Height - Seated (Max): 0.016" (0.40mm); Supplier Device Package: 0402; Failure Rate: -; Composition: Thick Film; Part Status: Active; Size / Dimension: 0.039" L x 0.020" W (1.00mm x 0.50mm); Operating Temperature: -55°C ~ 155°C; Packaging: Cut Tape (CT); Features: Moisture Resistant; Supplier Part Number 1: YAG3045CT-ND; Category: Resistors; Supplier 1: Digi-Key
R99 R107 R108 R110 R111 R113-R115 R117-R132 R134 R135 = Res_0402: Manufacturer Part Number 1: RC0402JR-070RL; Manufacturer: Yageo; Part Description: RES SMD 0.0OHM JUMPER 1/16W 0402; Resistance (Ohms): 0.0; Tolerance: Jumper; Power (Watts): 0.063W, 1/16W; Value: 0R; Supplier 1: Digi-Key; Supplier Part Number 1: 311-0.0JRTR-ND; Category: Resistors; Temperature Coefficient: -; Features: Moisture Resistant; Supplier Device Package: 0402; Height: 0.016" (0.40mm); Package / Case: 0402 (1005 Metric); Operating Temperature: -55°C ~ 155°C; Size / Dimension: 0.039" L x 0.020" W (1.00mm x 0.50mm); Composition: Thick Film; Packaging: Tape & Reel (TR); Number of Terminations: 2; RoHS: RoHS Compliant
R100 = Res_0402: Manufacturer: Yageo; Manufacturer Part Number 1: RC0402FR-071K5L; Part Description: 1.5 kOhms ±1% 0.063W, 1/16W Chip Resistor 0402 (1005 Metric) Moisture Resistant Thick Film; Resistance: 1.5kR; Power Rating: 62.5mW; Voltage Rating: 50V; Temperature Coefficient: 100ppm/°C; Max Power Dissipation: 63mW; ComponentLink1URL: https://datasheet.ciiva.com/12576/pyu-ac-51-rohs-l-2-12576779.pdf?src-supplier=Mouser; ComponentLink1Description: https://datasheet.ciiva.com/12576/pyu-ac-51-rohs-l-2-12576779.pdf?src-supplier=Mouser; Value: 1.5k, 1%; Supplier 1: Digi-Key; Supplier Part Number 1: 311-1.50KLRCT-ND; Stock 1: 2710950; Pricing 1: 1=0,10000, 10=0,01500, 100=0,00610, 1000=0,00275, 2500=0,00239, 5000=0,00197 (USD); RoHS: Yes; Case/Package: 0402; Case Code (Metric): 1005; Case Code (Imperial): 0402; Size Code: 0402; Min Operating Temperature: -55°C; Max Operating Temperature: 155°C; Package Quantity: 1; Tolerance: 1%; Packaging: Tape and Reel; Resistor Type: Thick Film; Number of Terminations: 2; Termination: SMD/SMT; Features: Moisture Resistant; Series: RC; Resistance Tolerance: 1%; Construction: Rectangular; Technology: THICK FILM; Length: 1mm; Width: 0.02inch; Height: 0.016inch; Depth: 0.5mm; REACH SVHC: No SVHC; Military Standard: Not; Lead Free: Lead Free; RoHS Compliant: Yes; ComponentLink2URL: https://datasheet.ciiva.com/11808/0900766b80c66297-11808238.pdf?src-supplier=RSComponents; ComponentLink2Description: https://datasheet.ciiva.com/11808/0900766b80c66297-11808238.pdf?src-supplier=RSComponents; ComponentLink3URL: https://datasheet.ciiva.com/46394/1018594-46394950.pdf?src-supplier=Element14; ComponentLink3Description: https://datasheet.ciiva.com/46394/1018594-46394950.pdf?src-supplier=Element14; ComponentLink4URL: https://datasheet.ciiva.com/2453/pyu-r-int-thick-7-2453440.pdf?src-supplier=Digi-Key; ComponentLink4Description: https://datasheet.ciiva.com/2453/pyu-r-int-thick-7-2453440.pdf?src-supplier=Digi-Key; ComponentLink5URL: https://datasheet.ciiva.com/2453/pyu-r-int-thick-7-2453441.pdf?src-supplier=Digi-Key; ComponentLink5Description: https://datasheet.ciiva.com/2453/pyu-r-int-thick-7-2453441.pdf?src-supplier=Digi-Key; ComponentLink6URL: https://datasheet.ciiva.com/2453/pyu-r-int-thick-7-2453439.pdf?src-supplier=Digi-Key; ComponentLink6Description: https://datasheet.ciiva.com/2453/pyu-r-int-thick-7-2453439.pdf?src-supplier=Digi-Key; ComponentLink7URL: https://datasheet.ciiva.com/12558/pyu-rc0402-51-rohs-l-6-r-8721-12558542.pdf?src-supplier=Mouser; ComponentLink7Description: https://datasheet.ciiva.com/12558/pyu-rc0402-51-rohs-l-6-r-8721-12558542.pdf?src-supplier=Mouser; ComponentLink8URL: https://datasheet.ciiva.com/7849/1018594-7849863.pdf?src-supplier=Element14; ComponentLink8Description: https://datasheet.ciiva.com/7849/1018594-7849863.pdf?src-supplier=Element14; ComponentLink9URL: https://datasheet.ciiva.com/7849/1018594-7849864.pdf?src-supplier=Element14; ComponentLink9Description: https://datasheet.ciiva.com/7849/1018594-7849864.pdf?src-supplier=Element14; ComponentLink10URL: https://datasheet.ciiva.com/15189/getdatasheetpartid-323992-15189370.pdf?src-supplier=Verical; ComponentLink10Description: https://datasheet.ciiva.com/15189/getdatasheetpartid-323992-15189370.pdf?src-supplier=Verical
R109 = Res_0402: Manufacturer: Stackpole Electronics Inc; Manufacturer Part Number 1: RMCF0402FT1K00; Part Description: RES SMD 1K OHM 1% 1/16W 0402; Temperature Coefficient: ±100ppm/°C; Power (Watts): 0.063W, 1/16W; Value: 1k, 1%; Supplier 1: Digi-Key; Supplier Part Number 1: RMCF0402FT1K00TR-ND; Resistance (Ohms): 1k; Packaging: Tape & Reel (TR); Category: Resistors; RoHS: RoHS Compliant; Tolerance: ±1%; Height: 0.016" (0.40mm); Number of Terminations: 2; Package / Case: 0402 (1005 Metric); Operating Temperature: -55°C ~ 155°C; Features: -; Composition: Thick Film; Supplier Device Package: 0402; Size / Dimension: 0.039" L x 0.020" W (1.00mm x 0.50mm)
R112 R116 = Res_0402: Manufacturer: Stackpole Electronics Inc; Manufacturer Part Number 1: RMCF0402FT2K20; Part Description: RES SMD 2.2K OHM 1% 1/16W 0402; Resistance (Ohms): 2.2k; Temperature Coefficient: ±100ppm/°C; Power (Watts): 0.063W, 1/16W; Value: 2k2, 1%; Supplier 1: Digi-Key; Supplier Part Number 1: RMCF0402FT2K20CT-ND; Supplier Device Package: 0402; Package / Case: 0402 (1005 Metric); Size / Dimension: 0.039" L x 0.020" W (1.00mm x 0.50mm); Operating Temperature: -55°C ~ 155°C; Composition: Thick Film; Category: Resistors; Features: -; Height: 0.016" (0.40mm); RoHS: RoHS Compliant; Number of Terminations: 2; Packaging: Cut Tape (CT); Tolerance: ±1%
R133 = Res_0402: Manufacturer: Yageo; Manufacturer Part Number 1: RC0402FR-0710KL; Part Description: RES SMD 10K OHM 1% 1/16W 0402; Temperature Coefficient: ±100ppm/°C; Power (Watts): 0.063W, 1/16W; Value: 10k, 1%; Supplier 1: Digi-Key; Supplier Part Number 1: 311-10.0KLRTR-ND; Resistance (Ohms): 10k; Packaging: Tape & Reel (TR); RoHS: RoHS Compliant; Package / Case: 0402 (1005 Metric); Tolerance: ±1%; Operating Temperature: -55°C ~ 155°C; Size / Dimension: 0.039" L x 0.020" W (1.00mm x 0.50mm); Number of Terminations: 2; Category: Resistors; Height: 0.016" (0.40mm); Supplier Device Package: 0402; Features: Moisture Resistant; Composition: Thick Film
VD9-VD16 = DIODE_TVS: Manufacturer 1: Sangdest Microelectronics; Manufacturer Part Number: SD03LCC; Part Description: 19V Clamp 20A (8/20µs) Ipp Tvs Diode Surface Mount SOD-323; ComponentLink1URL: https://datasheet.ciiva.com/29588/littelfuse-tvs-diode-array-sp4020-datasheet-pdf-29588193.pdf?src-supplier=Digi-Key; ComponentLink1Description: https://datasheet.ciiva.com/29588/littelfuse-tvs-diode-array-sp4020-datasheet-pdf-29588193.pdf?src-supplier=Digi-Key; ComponentLink2URL: https://datasheet.ciiva.com/24111/littelfuse-sp4020-267385-24111169.pdf?src-supplier=Mouser; ComponentLink2Description: https://datasheet.ciiva.com/24111/littelfuse-sp4020-267385-24111169.pdf?src-supplier=Mouser; Supplier 1: Digi-Key; Supplier Part Number 1: 1655-SD03LCCCT-ND; Stock 1: 8808; Pricing 1: 1=0,37000, 10=0,27300, 100=0,15460, 500=0,10240, 1000=0,07851 (USD); RoHS: No; Manufacturer: Sangdest Microelectronics; Manufacturer Part Number 1: SD03LCC
XT2 = CRYSTAL_2PIN: Part Description: Crystals 6.0 MHZ 30PPM -20+70C; Manufacturer: Abracon; Manufacturer Part Number 1: ABLS-6.000MHZ-B4-T; Load Capacitance: 18pF; ESR (Equivalent Series Resistance): 100R; Tolerance: 30ppm; Frequency Stability: 50ppm; Supplier 1: Digi-Key; Supplier Part Number 1: 535-10208-1-ND; Stock 1: 39384; Pricing 1: 1=0,33000, 10=0,27800, 50=0,25000, 100=0,22220, 500=0,21108 (USD); RoHS: Yes; Mount: Surface Mount; Case/Package: SMD/SMT; Min Operating Temperature: -20°C; Max Operating Temperature: 70°C; Frequency: 6MHz; Packaging: Tape and Reel; Package Quantity: 1000; Frequency Tolerance: 30ppm; Termination: SMD/SMT; Series Resistance: 100R; Length: 11.4mm; Width: 4.7mm; Height: 0.165inch; Depth: 4.7mm; Radiation Hardening: No; REACH SVHC: Yes; Lead Free: Lead Free; ComponentLink1URL: https://datasheet.ciiva.com/15116/getdatasheetpartid-722413-15116851.pdf?src-supplier=Verical; ComponentLink1Description: https://datasheet.ciiva.com/15116/getdatasheetpartid-722413-15116851.pdf?src-supplier=Verical; ComponentLink2URL: https://datasheet.ciiva.com/16378/abls-16378057.pdf?src-supplier=Future+Electronics; ComponentLink2Description: https://datasheet.ciiva.com/16378/abls-16378057.pdf?src-supplier=Future+Electronics; ComponentLink3URL: https://datasheet.ciiva.com/854/abls-854139.pdf?src-supplier=Digi-Key; ComponentLink3Description: https://datasheet.ciiva.com/854/abls-854139.pdf?src-supplier=Digi-Key; ComponentLink4URL: https://datasheet.ciiva.com/854/abls-854140.pdf?src-supplier=Digi-Key; ComponentLink4Description: https://datasheet.ciiva.com/854/abls-854140.pdf?src-supplier=Digi-Key; ComponentLink5URL: https://datasheet.ciiva.com/854/abls-854138.pdf?src-supplier=Digi-Key; ComponentLink5Description: https://datasheet.ciiva.com/854/abls-854138.pdf?src-supplier=Digi-Key; ComponentLink6URL: https://datasheet.ciiva.com/3175/abls-3175436.pdf?src-supplier=Avnet; ComponentLink6Description: https://datasheet.ciiva.com/3175/abls-3175436.pdf?src-supplier=Avnet